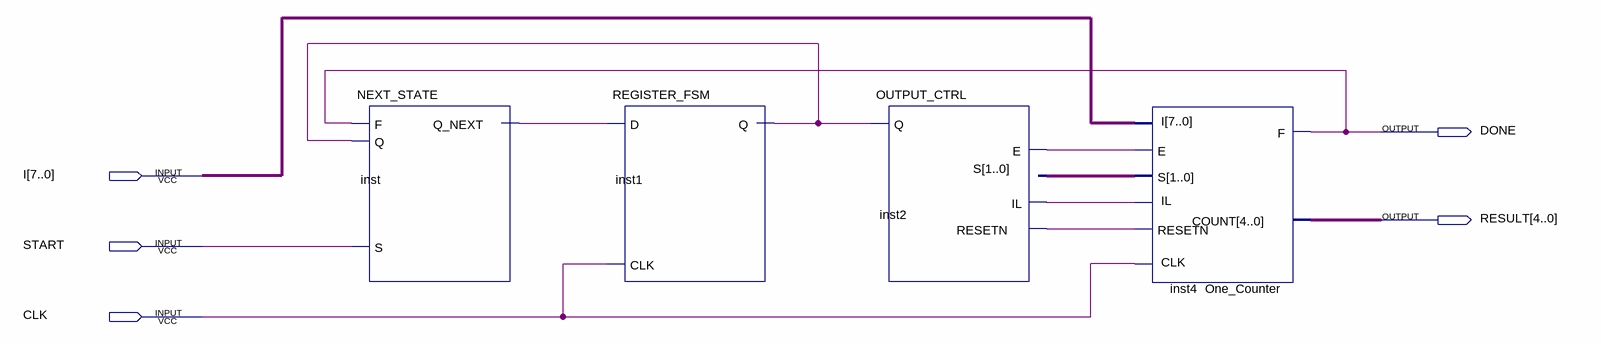
[diagram p0: schematic sheet]
// Quartus schematic TOP.bdf as structural Verilog: 4 symbols, 5 pins
module TOP (
  input  [7:0] I,
  input  START,
  input  CLK,
  output DONE,
  output [4:0] RESULT
);

  wire inst1_q, inst2_e, inst2_il, inst2_resetn, inst_q_next;
  wire [1:0] inst2_s;

  NEXT_STATE inst (.F(DONE), .Q(inst1_q), .S(START), .Q_NEXT(inst_q_next));
  REGISTER_FSM inst1 (.D(inst_q_next), .CLK(CLK), .Q(inst1_q));
  OUTPUT_CTRL inst2 (.Q(inst1_q), .E(inst2_e), .S(inst2_s), .RESETN(inst2_resetn), .IL(inst2_il));
  One_Counter inst4 (
    .E(inst2_e), .S(inst2_s), .I(I), .IL(inst2_il), .CLK(CLK), .RESETN(inst2_resetn), .F(DONE), .COUNT(RESULT));
endmodule
